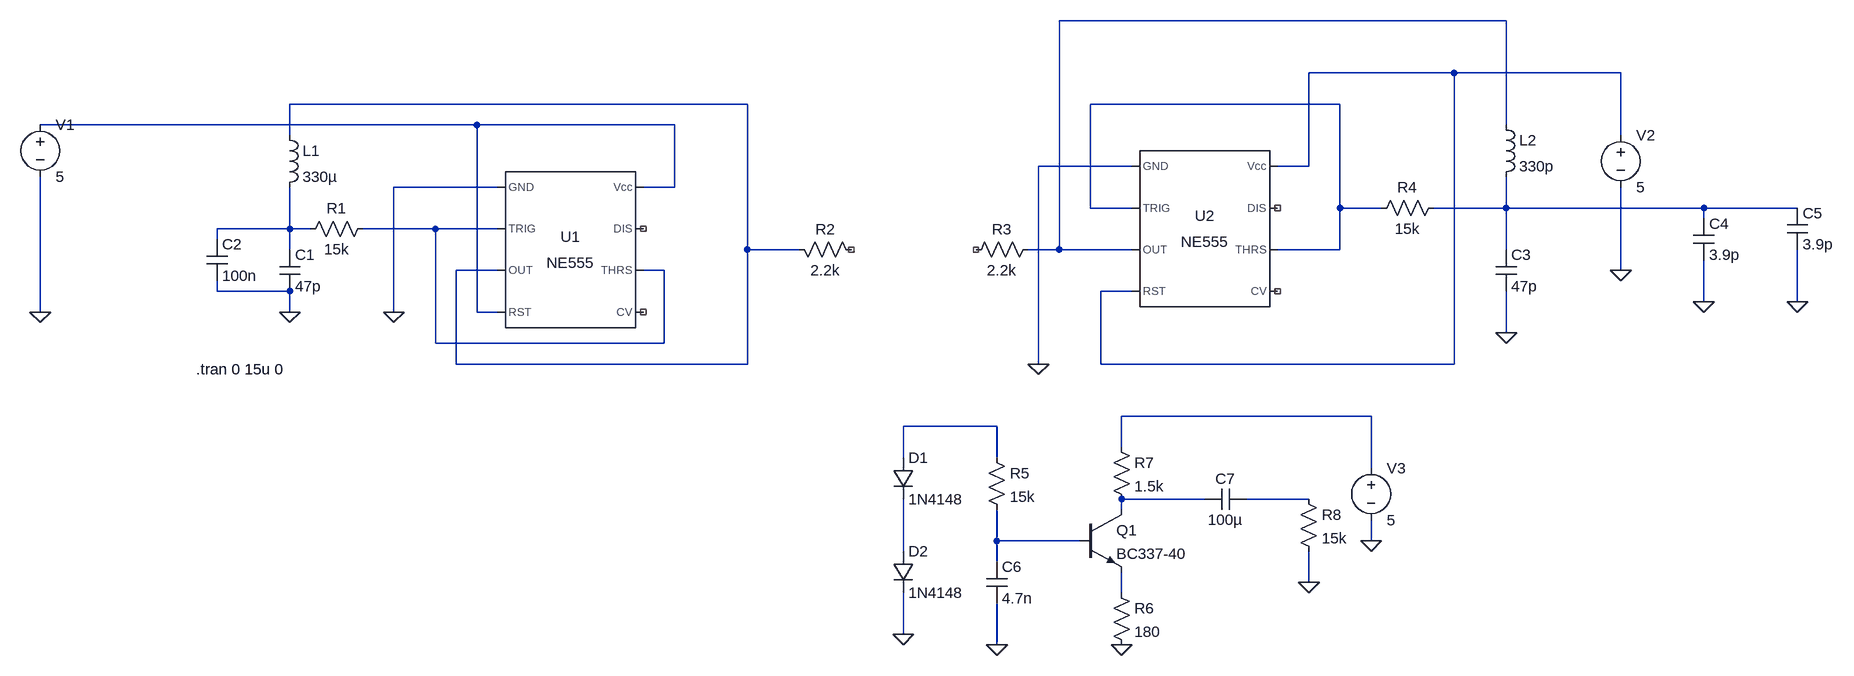
[diagram p0: schematic Draft1.asc]
Draft1.asc, the LTspice schematic file:
Version 4
SHEET 1 2160 820
WIRE 1648 -160 960 -160
WIRE 1568 -80 1344 -80
WIRE 1824 -80 1568 -80
WIRE 480 -32 -224 -32
WIRE 1392 -32 1008 -32
WIRE 64 0 -608 0
WIRE 368 0 64 0
WIRE 1648 0 1648 -160
WIRE -224 16 -224 -32
WIRE 1824 16 1824 -80
WIRE 1072 64 928 64
WIRE 1344 64 1344 -80
WIRE 1344 64 1296 64
WIRE 96 96 -64 96
WIRE 368 96 368 0
WIRE 368 96 320 96
WIRE 1008 128 1008 -32
WIRE 1072 128 1008 128
WIRE 1392 128 1392 -32
WIRE 1456 128 1392 128
WIRE 1648 128 1648 80
WIRE 1648 128 1536 128
WIRE 1952 128 1648 128
WIRE 2096 128 1952 128
WIRE 1952 144 1952 128
WIRE -224 160 -224 96
WIRE -224 160 -336 160
WIRE -192 160 -224 160
WIRE 0 160 -112 160
WIRE 96 160 0 160
WIRE -336 176 -336 160
WIRE -224 192 -224 160
WIRE 480 192 480 -32
WIRE 560 192 480 192
WIRE 960 192 960 -160
WIRE 960 192 912 192
WIRE 1072 192 960 192
WIRE 1392 192 1392 128
WIRE 1392 192 1296 192
WIRE 1648 192 1648 128
WIRE 96 224 32 224
WIRE 352 224 320 224
WIRE 1824 224 1824 96
WIRE -336 256 -336 240
WIRE -224 256 -336 256
WIRE 1072 256 1024 256
WIRE 1952 272 1952 208
WIRE 2096 272 2096 192
WIRE -608 288 -608 80
WIRE -224 288 -224 256
WIRE -64 288 -64 96
WIRE 64 288 64 0
WIRE 96 288 64 288
WIRE 1648 320 1648 256
WIRE 0 336 0 160
WIRE 352 336 352 224
WIRE 352 336 0 336
WIRE 32 368 32 224
WIRE 480 368 480 192
WIRE 480 368 32 368
WIRE 928 368 928 64
WIRE 1024 368 1024 256
WIRE 1568 368 1568 -80
WIRE 1568 368 1024 368
WIRE 1440 448 1056 448
WIRE 864 464 720 464
WIRE 1056 496 1056 448
WIRE 720 512 720 464
WIRE 864 512 864 464
WIRE 1440 528 1440 448
WIRE 1184 576 1056 576
WIRE 1344 576 1248 576
WIRE 1056 592 1056 576
WIRE 864 640 864 592
WIRE 992 640 864 640
WIRE 1440 640 1440 608
WIRE 720 656 720 576
WIRE 864 672 864 640
WIRE 1344 704 1344 656
WIRE 1056 720 1056 688
WIRE 720 784 720 720
WIRE 864 800 864 736
FLAG -64 288 0
FLAG -224 288 0
FLAG -608 288 0
FLAG 1648 320 0
FLAG 928 368 0
FLAG 1824 224 0
FLAG 1952 272 0
FLAG 2096 272 0
FLAG 720 784 0
FLAG 864 800 0
FLAG 1344 704 0
FLAG 1056 800 0
FLAG 1440 640 0
SYMBOL Misc\\NE555 208 192 R0
SYMATTR InstName U1
SYMBOL res -96 144 R90
WINDOW 0 0 56 VBottom 2
WINDOW 3 32 56 VTop 2
SYMATTR InstName R1
SYMATTR Value 15k
SYMBOL ind -240 0 R0
SYMATTR InstName L1
SYMATTR Value 330µ
SYMBOL cap -240 192 R0
SYMATTR InstName C1
SYMATTR Value 47p
SYMBOL cap -352 176 R0
SYMATTR InstName C2
SYMATTR Value 100n
SYMBOL voltage -608 -16 R0
WINDOW 123 0 0 Left 0
WINDOW 39 0 0 Left 0
SYMATTR InstName V1
SYMATTR Value 5
SYMBOL res 544 176 M90
WINDOW 0 0 56 VBottom 2
WINDOW 3 32 56 VTop 2
SYMATTR InstName R2
SYMATTR Value 2.2k
SYMBOL Misc\\NE555 1184 160 R0
SYMATTR InstName U2
SYMBOL res 928 176 R90
WINDOW 0 0 56 VBottom 2
WINDOW 3 32 56 VTop 2
SYMATTR InstName R3
SYMATTR Value 2.2k
SYMBOL ind 1632 -16 R0
SYMATTR InstName L2
SYMATTR Value 330p
SYMBOL cap 1632 192 R0
SYMATTR InstName C3
SYMATTR Value 47p
SYMBOL res 1552 112 R90
WINDOW 0 0 56 VBottom 2
WINDOW 3 32 56 VTop 2
SYMATTR InstName R4
SYMATTR Value 15k
SYMBOL voltage 1824 0 R0
WINDOW 123 0 0 Left 0
WINDOW 39 0 0 Left 0
SYMATTR InstName V2
SYMATTR Value 5
SYMBOL cap 1936 144 R0
SYMATTR InstName C4
SYMATTR Value 3.9p
SYMBOL cap 2080 128 R0
SYMATTR InstName C5
SYMATTR Value 3.9p
SYMBOL diode 704 512 R0
SYMATTR InstName D1
SYMATTR Value 1N4148
SYMBOL diode 704 656 R0
SYMATTR InstName D2
SYMATTR Value 1N4148
SYMBOL res 848 496 R0
SYMATTR InstName R5
SYMATTR Value 15k
SYMBOL cap 848 672 R0
SYMATTR InstName C6
SYMATTR Value 4.7n
SYMBOL npn 992 592 R0
SYMATTR InstName Q1
SYMATTR Value BC337-40
SYMBOL res 1040 704 R0
SYMATTR InstName R6
SYMATTR Value 180
SYMBOL res 1040 480 R0
SYMATTR InstName R7
SYMATTR Value 1.5k
SYMBOL res 1328 560 R0
SYMATTR InstName R8
SYMATTR Value 15k
SYMBOL cap 1248 560 R90
WINDOW 0 0 32 VBottom 2
WINDOW 3 32 32 VTop 2
SYMATTR InstName C7
SYMATTR Value 100µ
SYMBOL voltage 1440 512 R0
WINDOW 123 0 0 Left 0
WINDOW 39 0 0 Left 0
SYMATTR InstName V3
SYMATTR Value 5
TEXT -368 376 Left 2 !.tran 0 15u 0

The netlist it stands for:
* Draft1.asc
XU1 0 N008 N003 N005 NC_01 N008 NC_02 N005 NE555  ; pins GND TRIG OUT RST CV THRS DIS Vcc
R1 N008 N007 15k
L1 N003 N007 330µ
C1 N007 0 47p
C2 N007 0 100n
V1 N005 0 5
R2 N003 NC_03 2.2k
XU2 0 N004 N001 N002 NC_04 N004 NC_05 N002 NE555  ; pins GND TRIG OUT RST CV THRS DIS Vcc
R3 N001 NC_06 2.2k
L2 N001 N006 330p
C3 N006 0 47p
R4 N006 N004 15k
V2 N002 0 5
C4 N006 0 3.9p
C5 N006 0 3.9p
D1 N010 N014 1N4148
D2 N014 0 1N4148
R5 N010 N013 15k
C6 N013 0 4.7n
Q1 N011 N013 N015 0 BC337-40
R6 N015 0 180
R7 N009 N011 1.5k
R8 N012 0 15k
C7 N012 N011 100µ
V3 N009 0 5
.model D D
.lib standard.dio
.model NPN NPN
.model PNP PNP
.lib standard.bjt
.tran 0 15u 0
.lib NE555.sub
.backanno
.end